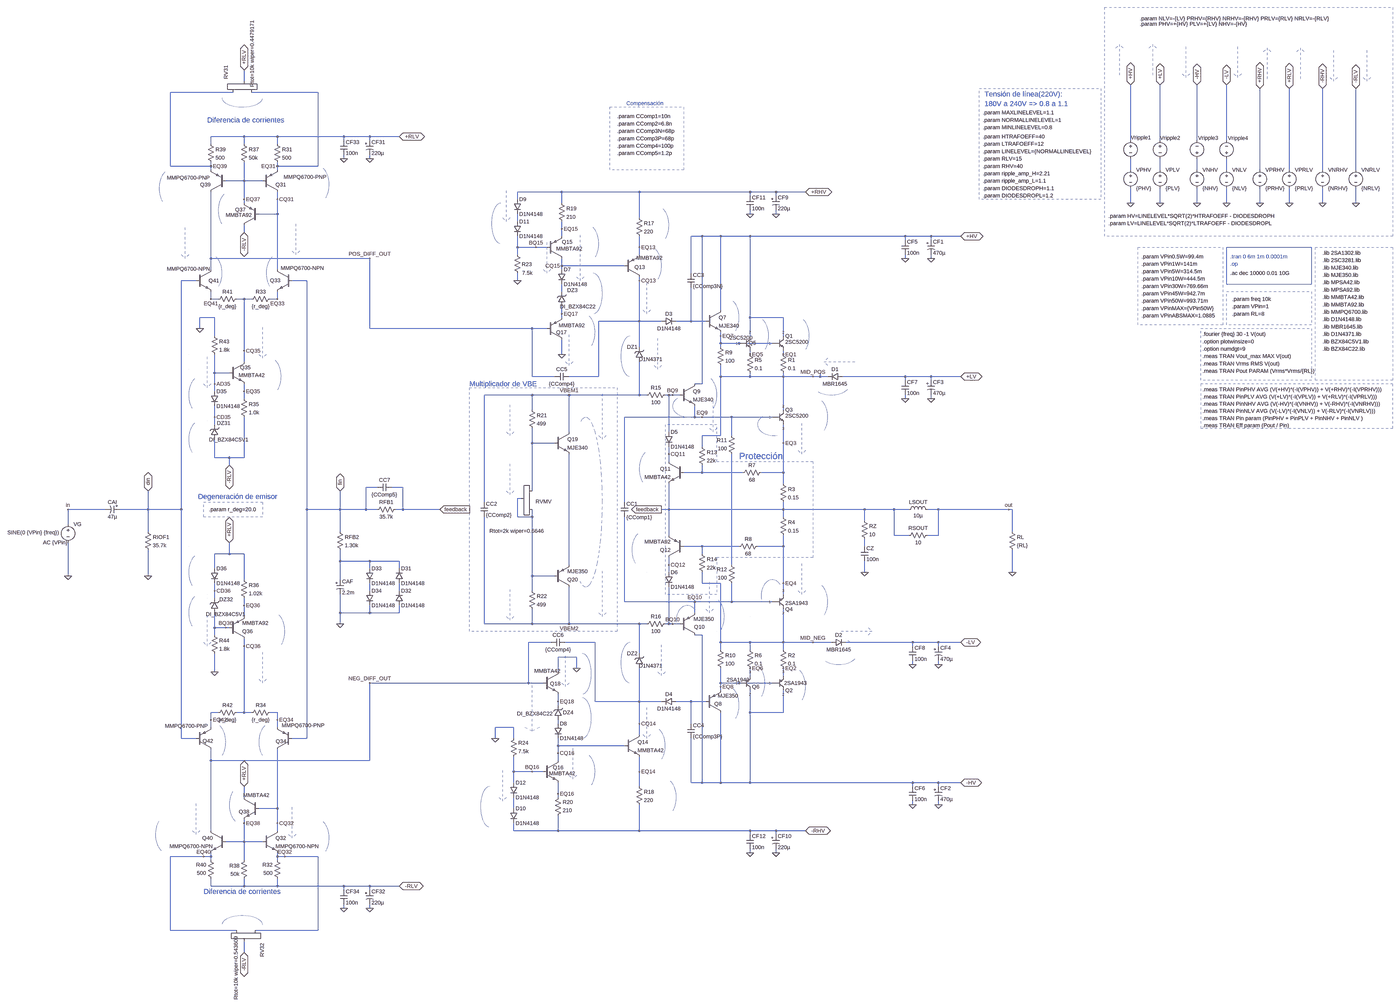
[diagram p0: schematic amplifier_V1.0_zobel_RF.asc, whole sheet]
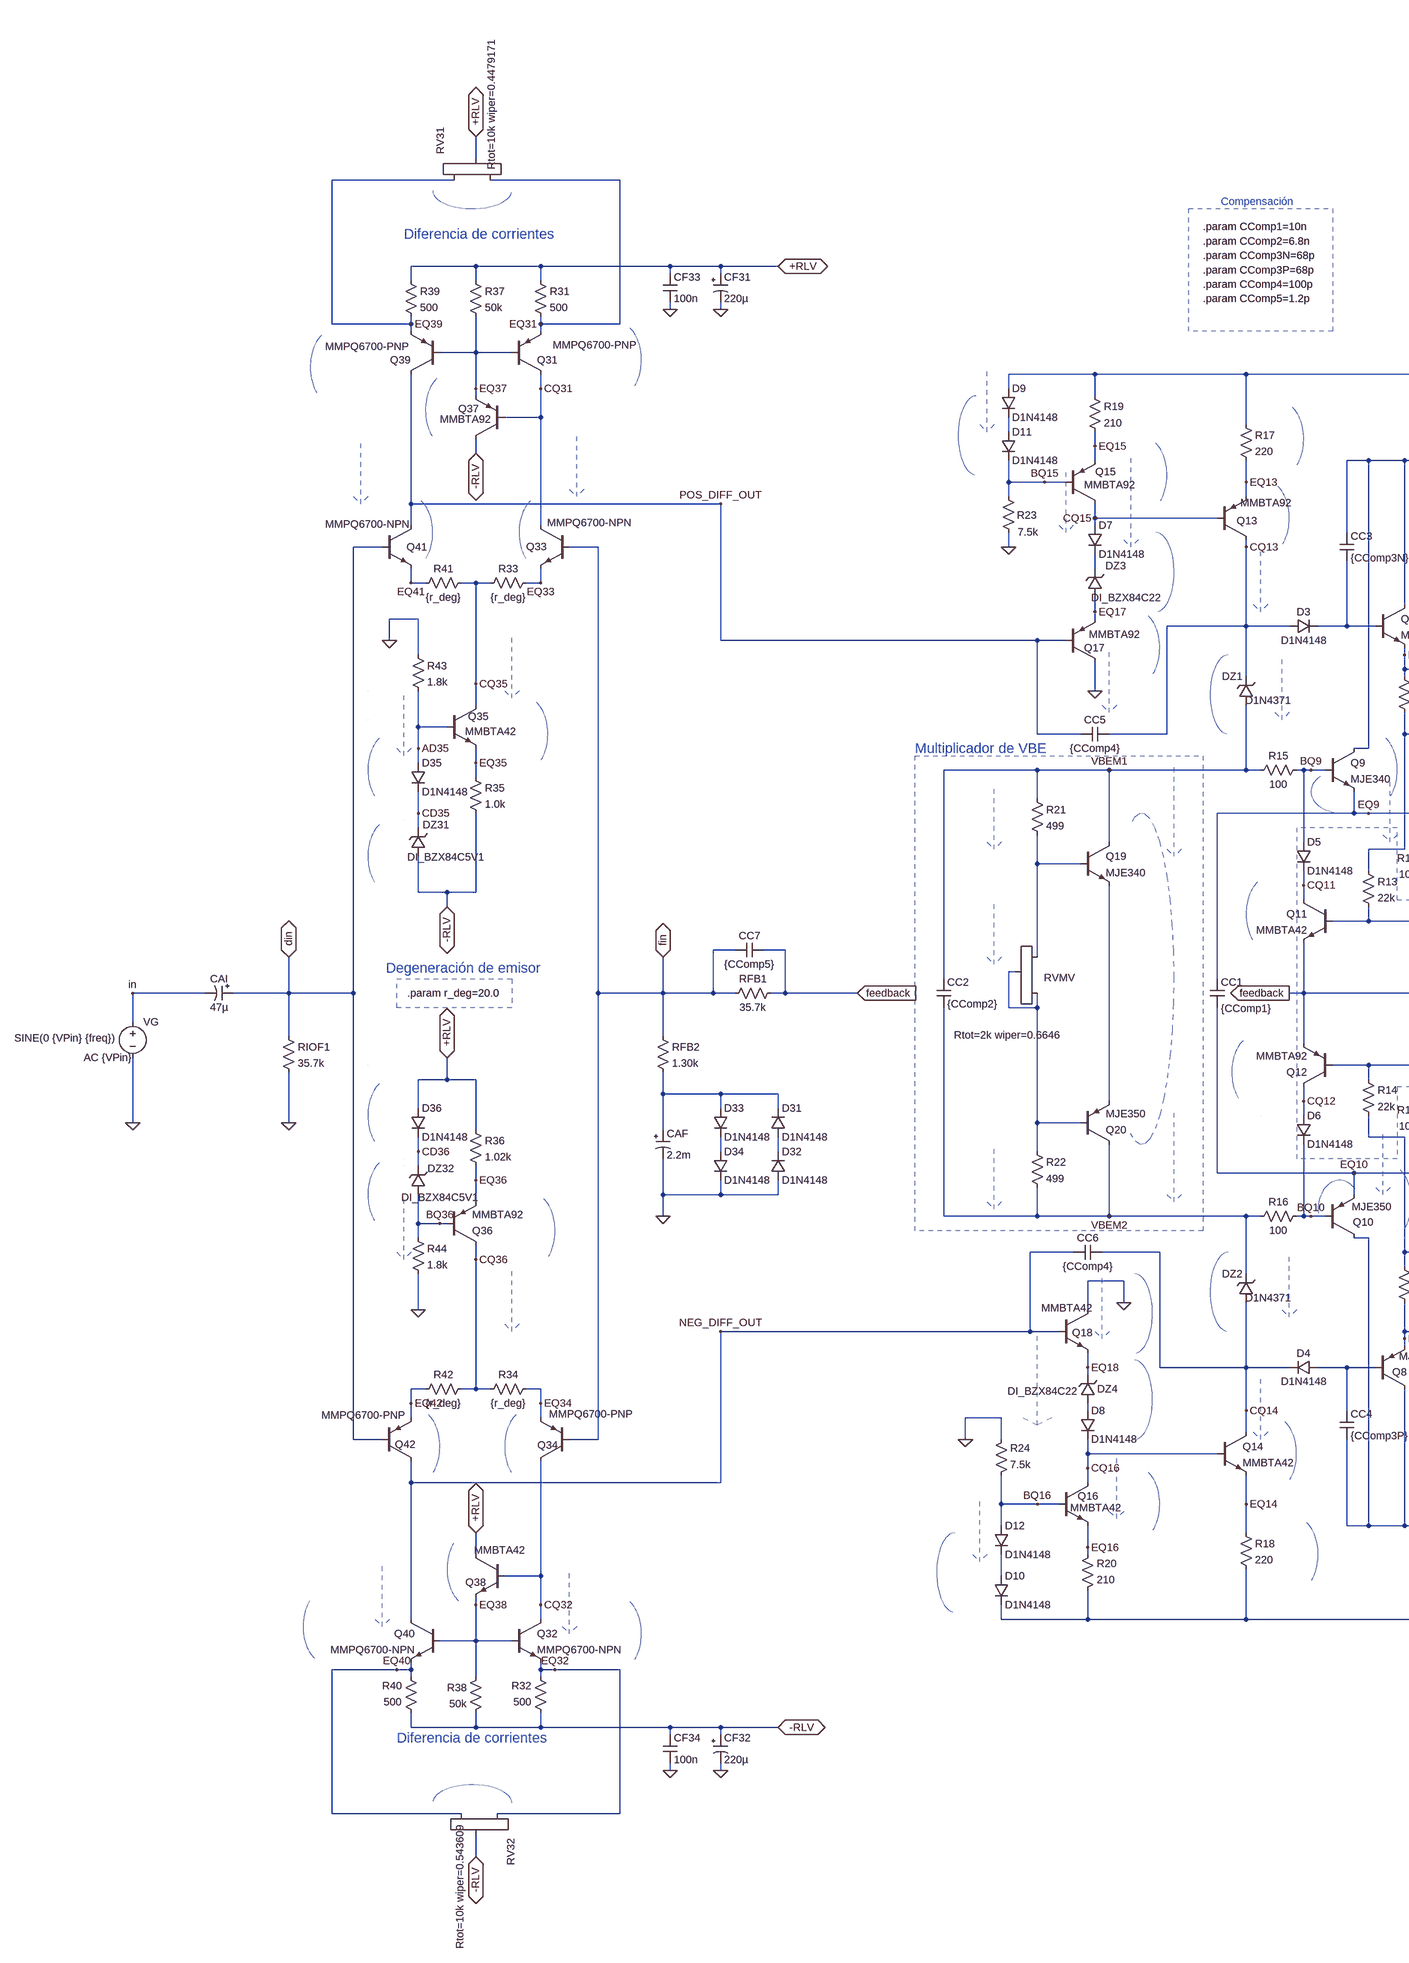
[diagram p1: schematic amplifier_V1.0_zobel_RF.asc, part, row 1 of 1, column 1 of 2]
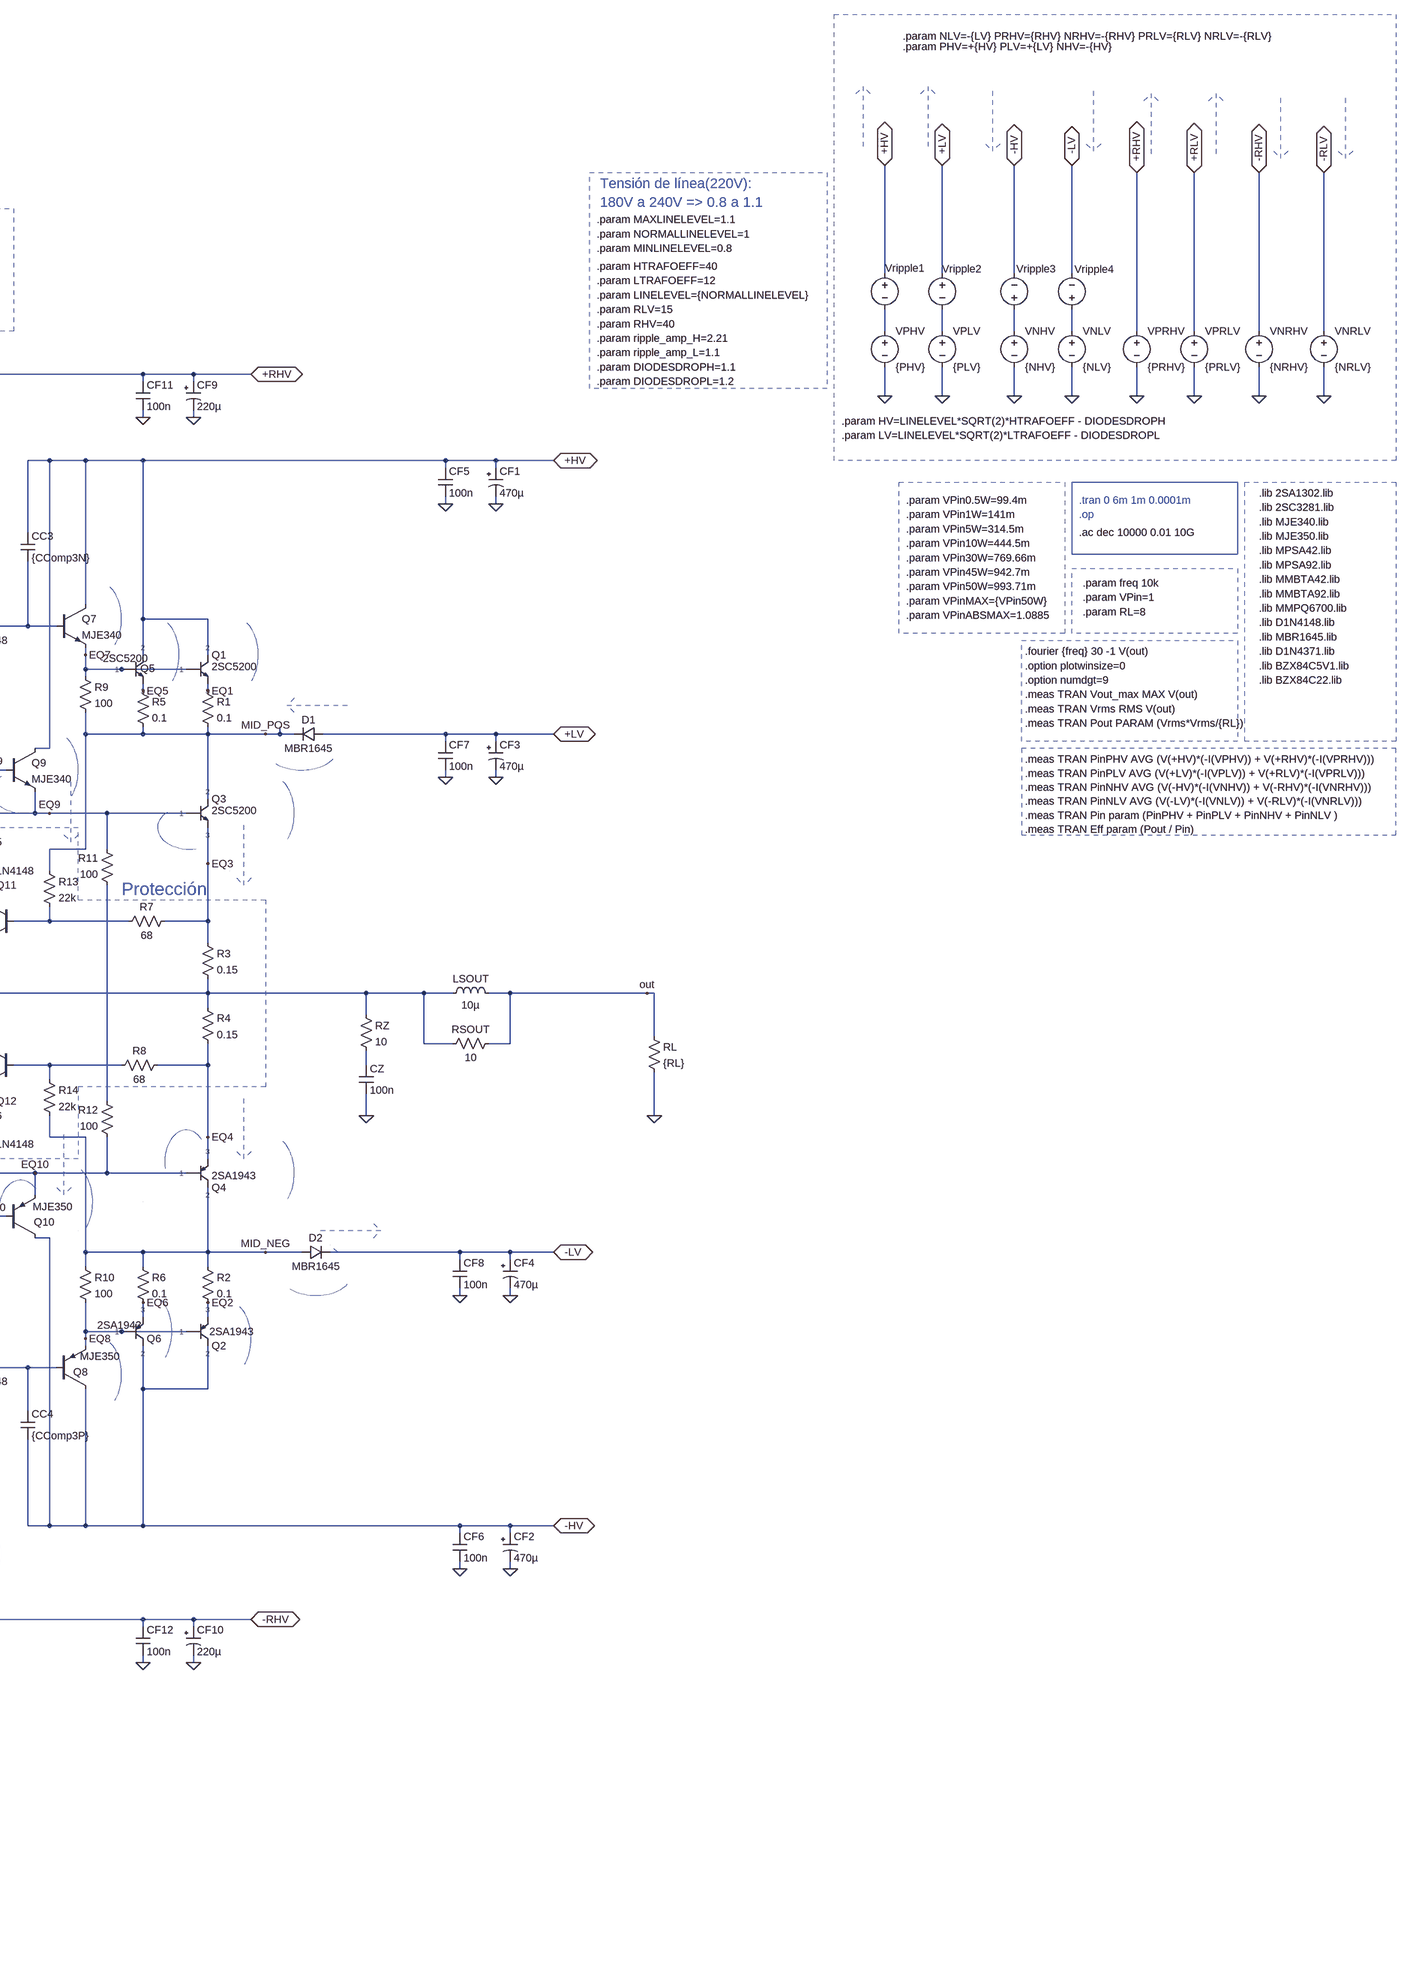
[diagram p2: schematic amplifier_V1.0_zobel_RF.asc, part, row 1 of 1, column 2 of 2]
* amplifier_V1.0_zobel_RF.asc
Q7 +HV N007 EQ7 0 MJE340
R9 EQ7 MID_POS 100
D3 CQ13 N007 D1N4148
Q9 +HV BQ9 EQ9 0 MJE340
R3 EQ3 feedback 0.15
R11 N015 EQ9 100
R4 feedback EQ4 0.15
Q10 -HV BQ10 EQ10 0 MJE350
Q8 -HV N018 EQ8 0 MJE350
D4 N018 CQ14 D1N4148
D2 MID_NEG -LV MBR1645
R12 EQ10 N015 100
R2 MID_NEG EQ2 0.1
R6 MID_NEG EQ6 0.1
R5 EQ5 MID_POS 0.1
R1 EQ1 MID_POS 0.1
D1 +LV MID_POS MBR1645
Q20 VBEM2 N010 N014 0 MJE350
Q19 VBEM1 N008 N014 0 MJE340
R21 VBEM1 N008 499
R22 N010 VBEM2 499
R15 BQ9 VBEM1 100
R16 BQ10 VBEM2 100
Q13 CQ13 CQ15 EQ13 0 MMBTA92
Q14 CQ14 CQ16 EQ14 0 MMBTA42
Q18 0 NEG_DIFF_OUT EQ18 0 MMBTA42
RFB2 fin N013 1.30k
RFB1 feedback fin 35.7k
RIOF1 din 0 35.7k
Q17 0 POS_DIFF_OUT EQ17 0 MMBTA92
Q41 POS_DIFF_OUT din EQ41 0 MMPQ6700-NPN
Q33 CQ31 fin EQ33 0 MMPQ6700-NPN
Q42 NEG_DIFF_OUT din EQ42 0 MMPQ6700-PNP
Q34 CQ32 fin EQ34 0 MMPQ6700-PNP
CC5 CQ13 POS_DIFF_OUT {CComp4}
CC6 CQ14 NEG_DIFF_OUT {CComp4}
Q31 CQ31 EQ37 EQ31 0 MMPQ6700-PNP
Q39 POS_DIFF_OUT EQ37 EQ39 0 MMPQ6700-PNP
Q40 NEG_DIFF_OUT EQ38 EQ40 0 MMPQ6700-NPN
Q32 CQ32 EQ38 EQ32 0 MMPQ6700-NPN
R17 +RHV EQ13 220
R18 EQ14 -RHV 220
R39 +RLV EQ39 500
R31 +RLV EQ31 500
R32 -RLV EQ32 500
R40 -RLV EQ40 500
Q38 +RLV CQ32 EQ38 0 MMBTA42
Q37 -RLV CQ31 EQ37 0 MMBTA92
R38 EQ38 -RLV 50k
R37 +RLV EQ37 50k
XQ5 +HV EQ7 EQ5 2SC5200  ; pins 2 1 3
XQ1 +HV EQ7 EQ1 2SC5200  ; pins 2 1 3
XQ3 MID_POS EQ9 EQ3 2SC5200  ; pins 2 1 3
XQ4 MID_NEG EQ10 EQ4 2SA1943  ; pins 2 1 3
XQ6 -HV EQ8 EQ6 2SA1943  ; pins 2 1 3
XQ2 -HV EQ8 EQ2 2SA1943  ; pins 2 1 3
R43 0 AD35 1.8k
Q35 CQ35 AD35 EQ35 0 MMBTA42
R35 EQ35 -RLV 1.0k
Q36 CQ36 BQ36 EQ36 0 MMBTA92
R36 +RLV EQ36 1.02k
R44 BQ36 0 1.8k
CC4 N018 -HV {CComp3P}
CC3 +HV N007 {CComp3N}
VG in 0 SINE(0 {VPin} {freq}) AC {VPin}
CF5 +HV 0 100n
XDZ31 -RLV CD35 DI_BZX84C5V1  ; pins + -
XDZ32 BQ36 CD36 DI_BZX84C5V1  ; pins + -
XRV32 EQ32 EQ40 -RLV Rtot=10k wiper=0.543609
XRV31 EQ39 EQ31 +RLV Rtot=10k wiper=0.4479171
CC7 feedback fin {CComp5}
Q15 CQ15 BQ15 EQ15 0 MMBTA92
R19 +RHV EQ15 210
R23 BQ15 0 7.5k
R20 -RHV EQ16 210
R24 BQ16 0 7.5k
Q16 CQ16 BQ16 EQ16 0 MMBTA42
D12 BQ16 N020 D1N4148
D10 N020 -RHV D1N4148
D9 +RHV N005 D1N4148
D11 N005 BQ15 D1N4148
D7 CQ15 N006 D1N4148
D8 N019 CQ16 D1N4148
XRVMV N010 N008 N010 Rtot=2k wiper=0.6646
D36 +RLV CD36 D1N4148
D35 AD35 CD35 D1N4148
Q12 CQ12 N011 feedback 0 MMBTA92
Q11 CQ11 N009 feedback 0 MMBTA42
D5 BQ9 CQ11 D1N4148
R7 EQ3 N009 68
R8 EQ4 N011 68
D6 CQ12 BQ10 D1N4148
R13 MID_POS N009 22k
R14 N011 MID_NEG 22k
R41 CQ35 EQ41 {r_deg}
R33 EQ33 CQ35 {r_deg}
R42 CQ36 EQ42 {r_deg}
R34 EQ34 CQ36 {r_deg}
CF1 +HV 0 470µ
CF7 +LV 0 100n
CF3 +LV 0 470µ
CF8 -LV 0 100n
CF4 -LV 0 470µ
CF6 -HV 0 100n
CF2 -HV 0 470µ
CF11 +RHV 0 100n
CF9 +RHV 0 220µ
CF12 -RHV 0 100n
CF10 -RHV 0 220µ
CF33 +RLV 0 100n
CF31 +RLV 0 220µ
CF34 -RLV 0 100n
CF32 -RLV 0 220µ
CAF N013 0 2.2m
D33 N013 N016 D1N4148
D34 N016 0 D1N4148
D32 0 N017 D1N4148
D31 N017 N013 D1N4148
CAI din in 47µ
R10 MID_NEG EQ8 100
CC2 VBEM1 VBEM2 {CComp2}
VPHV N001 0 {PHV}
VPLV N002 0 {PLV}
VNHV N003 0 {NHV}
VNLV N004 0 {NLV}
VPRHV +RHV 0 {PRHV}
VNRHV -RHV 0 {NRHV}
VPRLV +RLV 0 {PRLV}
VNRLV -RLV 0 {NRLV}
Vripple4 N004 -LV PULSE({ripple_amp_L} 0 0 10m 0 0 10m)
Vripple3 N003 -HV PULSE({ripple_amp_H} 0 0 10m 0 0 10m)
Vripple1 +HV N001 PULSE({ripple_amp_H} 0 0 10m 0 0 10m)
Vripple2 +LV N002 PULSE({ripple_amp_L} 0 0 10m 0 0 10m)
XDZ3 EQ17 N006 DI_BZX84C22  ; pins + -
XDZ4 N019 EQ18 DI_BZX84C22  ; pins + -
DZ1 VBEM1 CQ13 D1N4371
DZ2 CQ14 VBEM2 D1N4371
CC1 EQ9 EQ10 {CComp1}
RL out 0 {RL}
RZ feedback N012 10
CZ N012 0 100n
LSOUT feedback out 10µ
RSOUT out feedback 10
.model D D
.lib standard.dio
.model NPN NPN
.model PNP PNP
.lib standard.bjt
* .tran 0 6m 1m 0.0001m
.param freq 10k
* .op
.fourier {freq} 30 -1 V(out)
.lib 2SA1302.lib
.lib 2SC3281.lib
.lib MBR1645.lib
.lib MJE340.lib
.lib MJE350.lib
.lib D1N4148.lib
.lib MPSA42.lib
.lib MPSA92.lib
.ac dec 10000 0.01 10G
.param VPin=1
.lib BZX84C5V1.lib
.lib MMBTA42.lib
.lib MMBTA92.lib
.lib MMPQ6700.lib
.option plotwinsize=0
.meas TRAN Vrms RMS V(out)
.meas TRAN Pout PARAM (Vrms*Vrms/{RL})
.option numdgt=9
.meas TRAN Vout_max MAX V(out)
.param RL=8
.meas TRAN PinPHV AVG (V(+HV)*(-I(VPHV)) + V(+RHV)*(-I(VPRHV)))
.meas TRAN PinPLV AVG (V(+LV)*(-I(VPLV)) + V(+RLV)*(-I(VPRLV)))
.meas TRAN PinNHV AVG (V(-HV)*(-I(VNHV)) + V(-RHV)*(-I(VNRHV)))
.meas TRAN PinNLV AVG (V(-LV)*(-I(VNLV)) + V(-RLV)*(-I(VNRLV)))
.meas TRAN Pin param (PinPHV + PinPLV + PinNHV + PinNLV )
.meas TRAN Eff param (Pout / Pin)
* Multiplicador de VBE
.param r_deg=20.0
* Protección
* Degeneración de emisor
.param CComp1=10n
.param CComp3N=68p
.param CComp4=100p
* Compensación
.param CComp3P=68p
.param CComp5=1.2p
.param PHV=+{HV} PLV=+{LV} NHV=-{HV}
.param HV=LINELEVEL*SQRT(2)*HTRAFOEFF - DIODESDROPH
.param LV=LINELEVEL*SQRT(2)*LTRAFOEFF - DIODESDROPL
.param NLV=-{LV} PRHV={RHV} NRHV=-{RHV} PRLV={RLV} NRLV=-{RLV}
.lib D1N4371.lib
.lib BZX84C22.lib
* Diferencia de corrientes
* Diferencia de corrientes
.param CComp2=6.8n
.param VPin1W=141m
.param VPinABSMAX=1.0885
.param VPin5W=314.5m
.param VPin10W=444.5m
.param VPin45W=942.7m
.param VPin50W=993.71m
.param VPin30W=769.66m
.param VPin0.5W=99.4m
.param VPinMAX={VPin50W}
.param RHV=40
.param RLV=15
.param ripple_amp_H=2.21
.param ripple_amp_L=1.1
.param HTRAFOEFF=40
.param LTRAFOEFF=12
.param LINELEVEL={NORMALLINELEVEL}
* Tensión de línea(220V):
* 180V a 240V => 0.8 a 1.1
.param DIODESDROPH=1.1
.param MAXLINELEVEL=1.1
.param MINLINELEVEL=0.8
.param NORMALLINELEVEL=1
.param DIODESDROPL=1.2
.lib 2SC5200.mod
.lib 2SA1943.mod
.backanno
.end